# Altium schematic sheet MCU.SchDoc
size A4; SheetNumber: 1; SheetTotal: 7; SPICEModelCacheEMWNTBUM: <root> / <DocumentId>EMWNTBUM</DocumentId> / <CacheFrame Number="0"> / <Model Name="0603_885012006034_22pf" Kind="CKT"> / <Text>******* / .subckt 0603_885012006034_22pF 1 2 / Rser 1 3 0.352481322316 / Lser 2 4 5.8820344E-10 / C1 3 4 0.000000000022 / Rpar 3 4 10000000000 / .ends 0603_885012006034_22pF</Text> / </Model> / </CacheFrame> / </root>
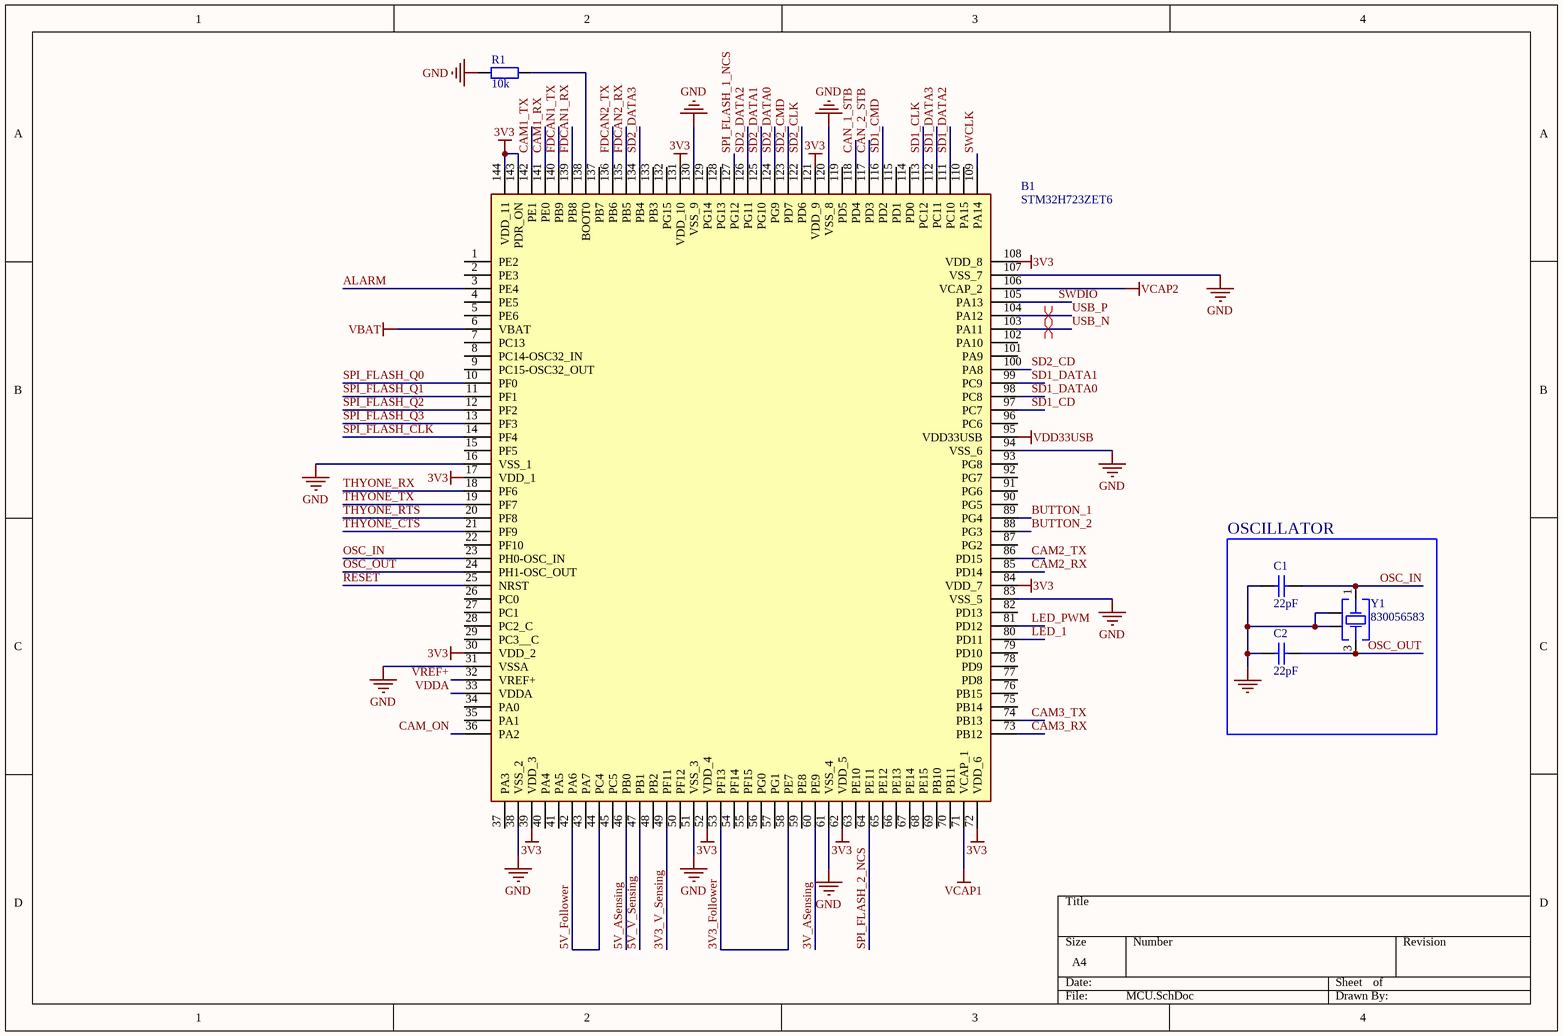
[diagram p0: MCU.SchDoc]

## Parts
B1  STM32H723ZET6  [QFP50P2200X2200X160-144N]
C1  value 22pF  [WCAP-CSGP_0603_L1.6W0.8H0.8_Reflow]  (hidden comment: 885012006034)
C2  value 22pF  [WCAP-CSGP_0603_L1.6W0.8H0.8_Reflow]  (hidden comment: 885012006034)
R1  value 10k  [WRIS-RSKS_0603_Reflow]  (hidden comment: 560112116005)
Y1  830056583  [WE-XTAL_CFPX-104]

## Blocks framed on the sheet
OSCILLATOR: C1 C2 Y1

## Nets
3V3: B1.17(VDD_1) B1.30(VDD_2) B1.39(VDD_3) B1.52(VDD_4) B1.62(VDD_5) B1.72(VDD_6) B1.84(VDD_7) B1.108(VDD_8) B1.121(VDD_9) B1.131(VDD_10) B1.143(PDR_ON) B1.144(VDD_11)
GND: B1.16(VSS_1) B1.31(VSSA) B1.38(VSS_2) B1.51(VSS_3) B1.61(VSS_4) B1.83(VSS_5) B1.94(VSS_6) B1.107(VSS_7) B1.120(VSS_8) B1.130(VSS_9) C1.2 C2.2 R1.2 Y1.2(GND_&_Lid) Y1.4(GND_&_Lid)
VBAT: B1.6(VBAT)
VCAP1: B1.71(VCAP_1)
VCAP2: B1.106(VCAP_2)
VDD33USB: B1.95(VDD33USB)
3V3_Follower: B1.53(PF13) B1.58(PE7)
3V3_V_Sensing: B1.49(PF11)
3V_ASensing: B1.60(PE9)
5V_ASensing: B1.46(PB0)
5V_Follower: B1.42(PA6) B1.44(PC4)
5V_V_Sensing: B1.47(PB1)
ALARM: B1.3(PE4)
BUTTON_1: B1.89(PG4)
BUTTON_2: B1.88(PG3)
CAM1_RX: B1.141(PE0)
CAM1_TX: B1.142(PE1)
CAM2_RX: B1.85(PD14)
CAM2_TX: B1.86(PD15)
CAM3_RX: B1.73(PB12)
CAM3_TX: B1.74(PB13)
CAM_ON: B1.36(PA2)
CAN_1_STB: B1.118(PD4)
CAN_2_STB: B1.117(PD3)
FDCAN1_RX: B1.139(PB8)
FDCAN1_TX: B1.140(PB9)
FDCAN2_RX: B1.135(PB5)
FDCAN2_TX: B1.136(PB6)
LED_1: B1.80(PD11)
LED_PWM: B1.81(PD12)
OSC_IN: B1.23(PH0-OSC_IN) C1.1 Y1.1(Crystal)
OSC_OUT: B1.24(PH1-OSC_OUT) C2.1 Y1.3(Crystal)
RESET: B1.25(NRST)
SD1_CD: B1.97(PC7)
SD1_CLK: B1.113(PC12)
SD1_CMD: B1.116(PD2)
SD1_DATA0: B1.98(PC8)
SD1_DATA1: B1.99(PC9)
SD1_DATA2: B1.111(PC10)
SD1_DATA3: B1.112(PC11)
SD2_CD: B1.100(PA8)
SD2_CLK: B1.122(PD6)
SD2_CMD: B1.123(PD7)
SD2_DATA0: B1.124(PG9)
SD2_DATA1: B1.125(PG10)
SD2_DATA2: B1.126(PG11)
SD2_DATA3: B1.134(PB4)
SPI_FLASH_1_NCS: B1.127(PG12)
SPI_FLASH_2_NCS: B1.64(PE11)
SPI_FLASH_CLK: B1.14(PF4)
SPI_FLASH_Q0: B1.10(PF0)
SPI_FLASH_Q1: B1.11(PF1)
SPI_FLASH_Q2: B1.12(PF2)
SPI_FLASH_Q3: B1.13(PF3)
SWCLK: B1.109(PA14)
SWDIO: B1.105(PA13)
THYONE_CTS: B1.21(PF9)
THYONE_RTS: B1.20(PF8)
THYONE_RX: B1.18(PF6)
THYONE_TX: B1.19(PF7)
USB_N: B1.103(PA11)
USB_P: B1.104(PA12)
VDDA: B1.33(VDDA)
VREF+: B1.32(VREF+)
NetB1_138: B1.138(BOOT0) R1.1

Not connected (* = marked no-connect by the designer): B1 1(PE2) 2(PE3) 4(PE5) 5(PE6) 7(PC13) 8(PC14-OSC32_IN) 9(PC15-OSC32_OUT) 15(PF5) 22(PF10) 26(PC0) 27(PC1) 28(PC2_C) 29(PC3__C) 34(PA0) 35(PA1) 37(PA3) 40(PA4) 41(PA5) 43(PA7) 45(PC5) 48(PB2) 50(PF12) 54(PF14) 55(PF15) 56(PG0) 57(PG1) 59(PE8) 63(PE10) 65(PE12) 66(PE13) 67(PE14) 68(PE15) 69(PB10) 70(PB11) 75(PB14) 76(PB15) 77(PD8) 78(PD9) 79(PD10) 82(PD13) 87(PG2) 90(PG5) 91(PG6) 92(PG7) 93(PG8) 96(PC6) 101(PA9) 102(PA10) 110(PA15) 114(PD0) 115(PD1) 119(PD5) 128(PG13) 129(PG14) 132(PG15) 133(PB3) 137(PB7)

## Layout directives
differential pair: USB_N, USB_P

## Library data of the parts
B1 = CMP-163-000000-3: High-performance and DSP with DP-FPU, Arm Cortex-M7 MCU with 512 Kbytes Flash, 564 Kbytes RAM, 550 MHz CPU, L1 cache, external memory interface, subset of peripherals; Manufacturer_Name: STMicroelectronics; Geometry.Height: 1.6mm; Source: STM32H723ZET6.SchLib; Mouser Price/Stock: https://www.mouser.co.uk/ProductDetail/STMicroelectronics/STM32H723ZET6?qs=sPbYRqrBIVnvdSB0MwAafg%3D%3D; Datasheet Link: https://www.st.com/resource/en/datasheet/stm32h723ve.pdf; Manufacturer_Part_Number: STM32H723ZET6; Mouser Part Number: 511-STM32H723ZET6; Design Item ID: STM32H723ZET6
C1 C2 = CMP-001-00150-1: WCAP-CSGP Multilayer Ceramic Chip Capacitor, General Purpose, size 0603, NP0, 22pF, 25VDC; Manufacturer: Wurth Elektronik; Q Factor: 840; Capacitance Tolerance: +/-5%; Insulation Resistance: 10GOhm; Technical Reference: NP00603220J025DFCT10000; Rated Voltage (DC): 25V; Category: Multilayer Ceramic Chip Capacitors; ComponentLink2URL: https://www.we-online.com/redexpert/spec/885012006034?ad; ComponentLink1Description: Website Link; Operating Temperature Max: 125°C; Ceramic Type: NP0; Operating Temperature Min: -55°C; Case/Package: 0603; Component Type: Standard; Width: 0.8mm; Source: WCAP-CSGP.SchLib; Pins: 2; Packaging: Tape and Reel; Mount: Surface Mount; ComponentLink2Description: Datasheet Link; ComponentLink1URL: https://www.we-online.com/redexpert/article/885012006034?ad; Manufacturer Part Number: 885012006034; Match Code: WCAP-CSGP; Design Item ID: 885012006034; Length: 1.6mm; Height: 0.8mm
R1 = CMP-009-00328-1: WRIS-RSKS Thick Film Resistor, size 0603, 10000Ohm, 100mW; Manufacturer: Wurth Elektronik; Limiting Element Voltage: 75V; Temperature Coefficient of Resistance Max: 100ppm/°C; Resistance Tolerance: +/-1%; Temperature Coefficient of Resistance Min: -100ppm/°C; ComponentLink1Description: Website Link; Case/Package: 0603; Pins: 2; Match Code: WRIS-RSKS; Operating Temperature Max: 155°C; Width: 0.8mm; Design Item ID: 560112116005; Length: 1.6mm; ComponentLink2Description: Datasheet Link; ComponentLink2URL: https://www.we-online.com/redexpert/spec/560112116005?ad; Packaging: Tape and Reel; Source: WRIS-RSKS.SchLib; Height: 0.45mm; Manufacturer Part Number: 560112116005; Component Type: Standard; Mount: Surface Mount; Operating Temperature Min: -55°C; Rated Power: 100mW; ComponentLink1URL: https://www.we-online.com/redexpert/article/560112116005?ad; Category: Thick Film Resistors
Y1 = CMP-003-00170-1: WE-XTAL Quartz Crystal, SMT, CFPX-104, 10MHz, +/-30ppm; Manufacturer: Wurth Elektronik; Load Capacitance: 12pF; Component Type: Standard; Operating Temperature Min: -40°C; Pins: 4; ComponentLink2URL: https://www.we-online.com/redexpert/spec/830056583?ad; Frequency Tolerance: +/-30ppm; Packaging: Tape and Reel; Match Code: WE-XTAL; Frequency Stability: +/-30ppm; ComponentLink1URL: https://www.we-online.com/redexpert/article/830056583?ad; Mount: Surface Mount; ComponentLink1Description: Website Link; Source: WE-XTAL.SchLib; Length: 5mm; Manufacturer Part Number: 830056583; Width: 3.2mm; Design Item ID: 830056583; Height: 1mm; Frequency: 10MHz; Operating Temperature Max: 85°C; Case/Package: CFPX-104; ComponentLink2Description: Datasheet Link; Category: Crystals